# EAGLE design Squama_Ethernet (EAGLE 6.4)

## Sheet 1 of 3
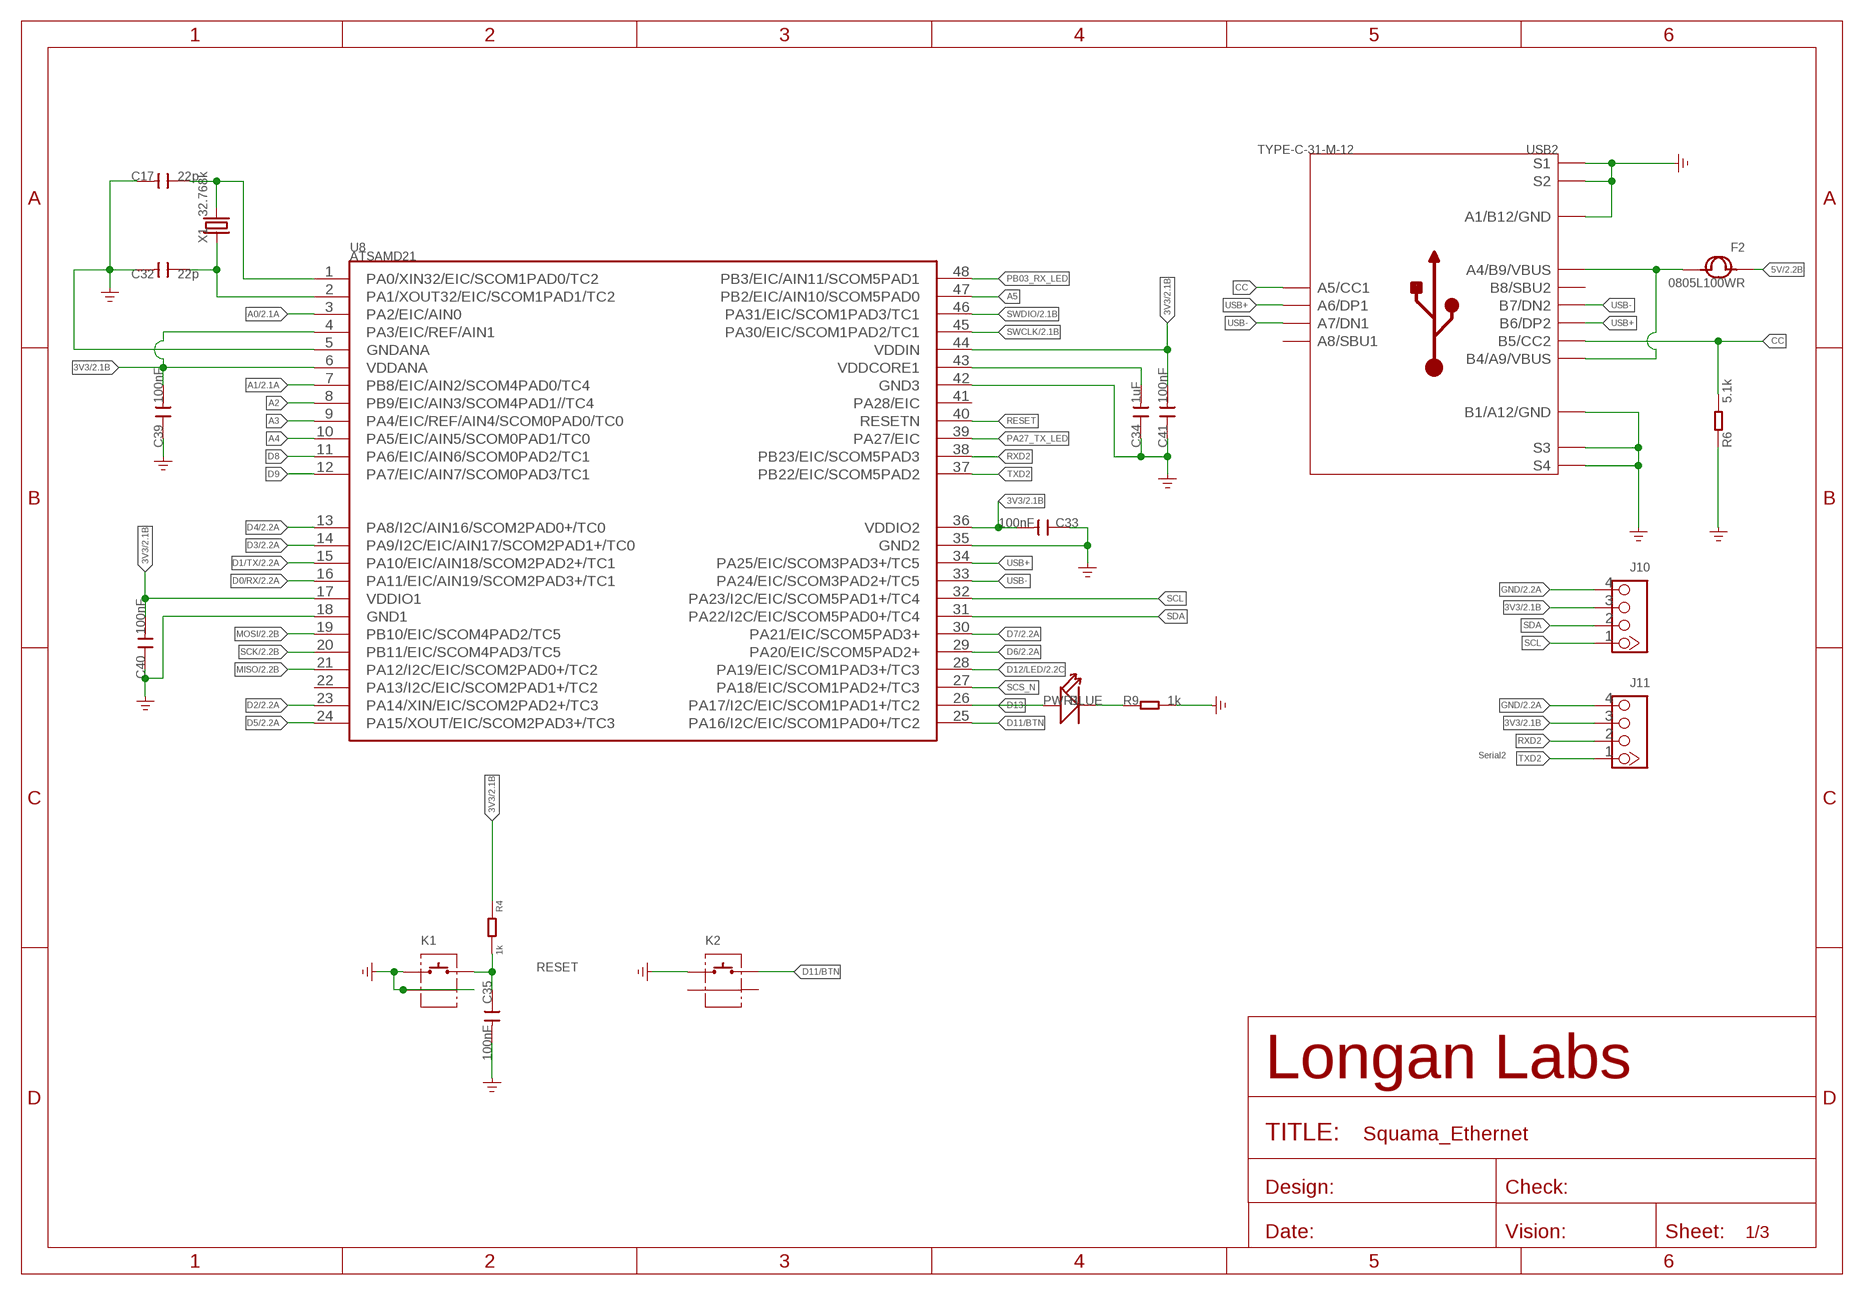
[diagram p0: schematic, sheet 1]

### Parts
C17  22p  CAP-0603  [C0603]
C32  22p  CAP-0603  [C0603]
C33  100nF  CAP-0603  [C0603]
C34  1uF  CAP-0603  [C0603]
C35  100nF  CAP-0603  [C0603]
C39  100nF  CAP-0603  [C0603]
C40  100nF  CAP-0603  [C0603]
C41  100nF  CAP-0603  [C0603]
F2  0805L100WR  FUSE0805  [F0805]
J10  320110033  GROVE-CONNECTOR-DIP-2.0  [HW4-2.0]
J11  320110033  GROVE-CONNECTOR-DIP-2.0  [HW4-2.0]
K1  BUTTON-2+2P  [SW2+2P-7.7X2.75X3.95MM]
K2  BUTTON-2+2P  [SW2+2P-7.7X2.75X3.95MM]
PWR1  BLUE  LED'0603'  [LED-0603]
R4  1k  RES-0603  [R0603]
R6  5.1k  RES-0603  [R0603]
R9  1k  R-0603  [R0603]
U8  ATSAMD21  MCU-ATSAMD21-TQFP48  [TQFP48-0.5-7X7MM]
USB2  TYPE-C-31-M-12  USB2.0-TYPE-C  [USB2.0-TYPE-C]
X1  32.768k  CRYSTAL-2P-3215  [X2-SMD-3.2X1.5X0.55MM]

### Nets
3V3: C33.2 C39.2 C40.2 C41.2 J10.3 J11.3 R4.1 U8.4(PA3/EIC/REF/AIN1) U8.6(VDDANA) U8.17(VDDIO1) U8.36(VDDIO2) U8.44(VDDIN) ; also sheet 2,3
5V [usbvcc]: F2.1 ; also sheet 2
A0: U8.3(PA2/EIC/AIN0) ; also sheet 2
A1: U8.7(PB8/EIC/AIN2/SCOM4PAD0/TC4) ; also sheet 2
A2: U8.8(PB9/EIC/AIN3/SCOM4PAD1//TC4)
A3: U8.9(PA4/EIC/REF/AIN4/SCOM0PAD0/TC0)
A4: U8.10(PA5/EIC/AIN5/SCOM0PAD1/TC0)
A5: U8.47(PB2/EIC/AIN10/SCOM5PAD0)
CC: R6.2 USB2.A5(A5/CC1) USB2.B5(B5/CC2)
D0/RX: U8.16(PA11/EIC/AIN19/SCOM2PAD3+/TC1) ; also sheet 2
D1/TX: U8.15(PA10/EIC/AIN18/SCOM2PAD2+/TC1) ; also sheet 2
D2: U8.23(PA14/XIN/EIC/SCOM2PAD2+/TC3) ; also sheet 2
D3: U8.14(PA9/I2C/EIC/AIN17/SCOM2PAD1+/TC0) ; also sheet 2
D4: U8.13(PA8/I2C/AIN16/SCOM2PAD0+/TC0) ; also sheet 2
D5: U8.24(PA15/XOUT/EIC/SCOM2PAD3+/TC3) ; also sheet 2
D6: U8.29(PA20/EIC/SCOM5PAD2+) ; also sheet 2
D7: U8.30(PA21/EIC/SCOM5PAD3+) ; also sheet 2
D8: U8.11(PA6/EIC/AIN6/SCOM0PAD2/TC1)
D9: U8.12(PA7/EIC/AIN7/SCOM0PAD3/TC1)
D11/BTN: K2.2 U8.25(PA16/I2C/EIC/SCOM1PAD0+/TC2)
D12/LED: U8.28(PA19/EIC/SCOM1PAD3+/TC3) ; also sheet 2
D13: PWR1.+ U8.26(PA17/I2C/EIC/SCOM1PAD1+/TC2)
GND: C17.2 C32.2 C33.1 C34.1 C35.2 C39.1 C40.1 C41.1 J10.4 J11.4 K1.1 K1.S1 K1.S2 K2.1 R6.1 R9.2 U8.5(GNDANA) U8.18(GND1) U8.35(GND2) U8.42(GND3) USB2.A1_B12(A1/B12/GND) USB2.B1_A12(B1/A12/GND) USB2.S1 USB2.S2 USB2.S3 USB2.S4 USB2.S5(S1) USB2.S6(S2) ; supply symbol labelled GND_POWER ; also sheet 2,3
MISO: U8.21(PA12/I2C/EIC/SCOM2PAD0+/TC2) ; also sheet 2,3
MOSI: U8.19(PB10/EIC/SCOM4PAD2/TC5) ; also sheet 2,3
N$2: PWR1.- R9.1
N$3: F2.2 USB2.A4_B9(A4/B9/VBUS) USB2.B4_A9(B4/A9/VBUS)
N$11: C17.1 U8.1(PA0/XIN32/EIC/SCOM1PAD0/TC2) X1.2
N$12: C32.1 U8.2(PA1/XOUT32/EIC/SCOM1PAD1/TC2) X1.1
N$13: C34.2 U8.43(VDDCORE1)
PA27_TX_LED: U8.39(PA27/EIC)
PB03_RX_LED: U8.48(PB3/EIC/AIN11/SCOM5PAD1)
RESET: C35.1 K1.2 R4.2 U8.40(RESETN)
RXD2: J11.2 U8.38(PB23/EIC/SCOM5PAD3)
SCK: U8.20(PB11/EIC/SCOM4PAD3/TC5) ; also sheet 2,3
SCL: J10.1 U8.32(PA23/I2C/EIC/SCOM5PAD1+/TC4)
SCS_N: U8.27(PA18/EIC/SCOM1PAD2+/TC3) ; also sheet 3
SDA: J10.2 U8.31(PA22/I2C/EIC/SCOM5PAD0+/TC4)
SWCLK: U8.45(PA30/EIC/SCOM1PAD2/TC1) ; also sheet 2
SWDIO: U8.46(PA31/EIC/SCOM1PAD3/TC1) ; also sheet 2
TXD2: J11.1 U8.37(PB22/EIC/SCOM5PAD2)
USB+: U8.34(PA25/EIC/SCOM3PAD3+/TC5) USB2.A6(A6/DP1) USB2.B6(B6/DP2)
USB-: U8.33(PA24/EIC/SCOM3PAD2+/TC5) USB2.A7(A7/DN1) USB2.B7(B7/DN2)
Unconnected: K2.S1 K2.S2 U8.22(PA13/I2C/EIC/SCOM2PAD1+/TC2) U8.41(PA28/EIC) USB2.A8(A8/SBU1) USB2.B8(B8/SBU2)

### Notes on the sheet
- Serial2

## Sheet 2 of 3
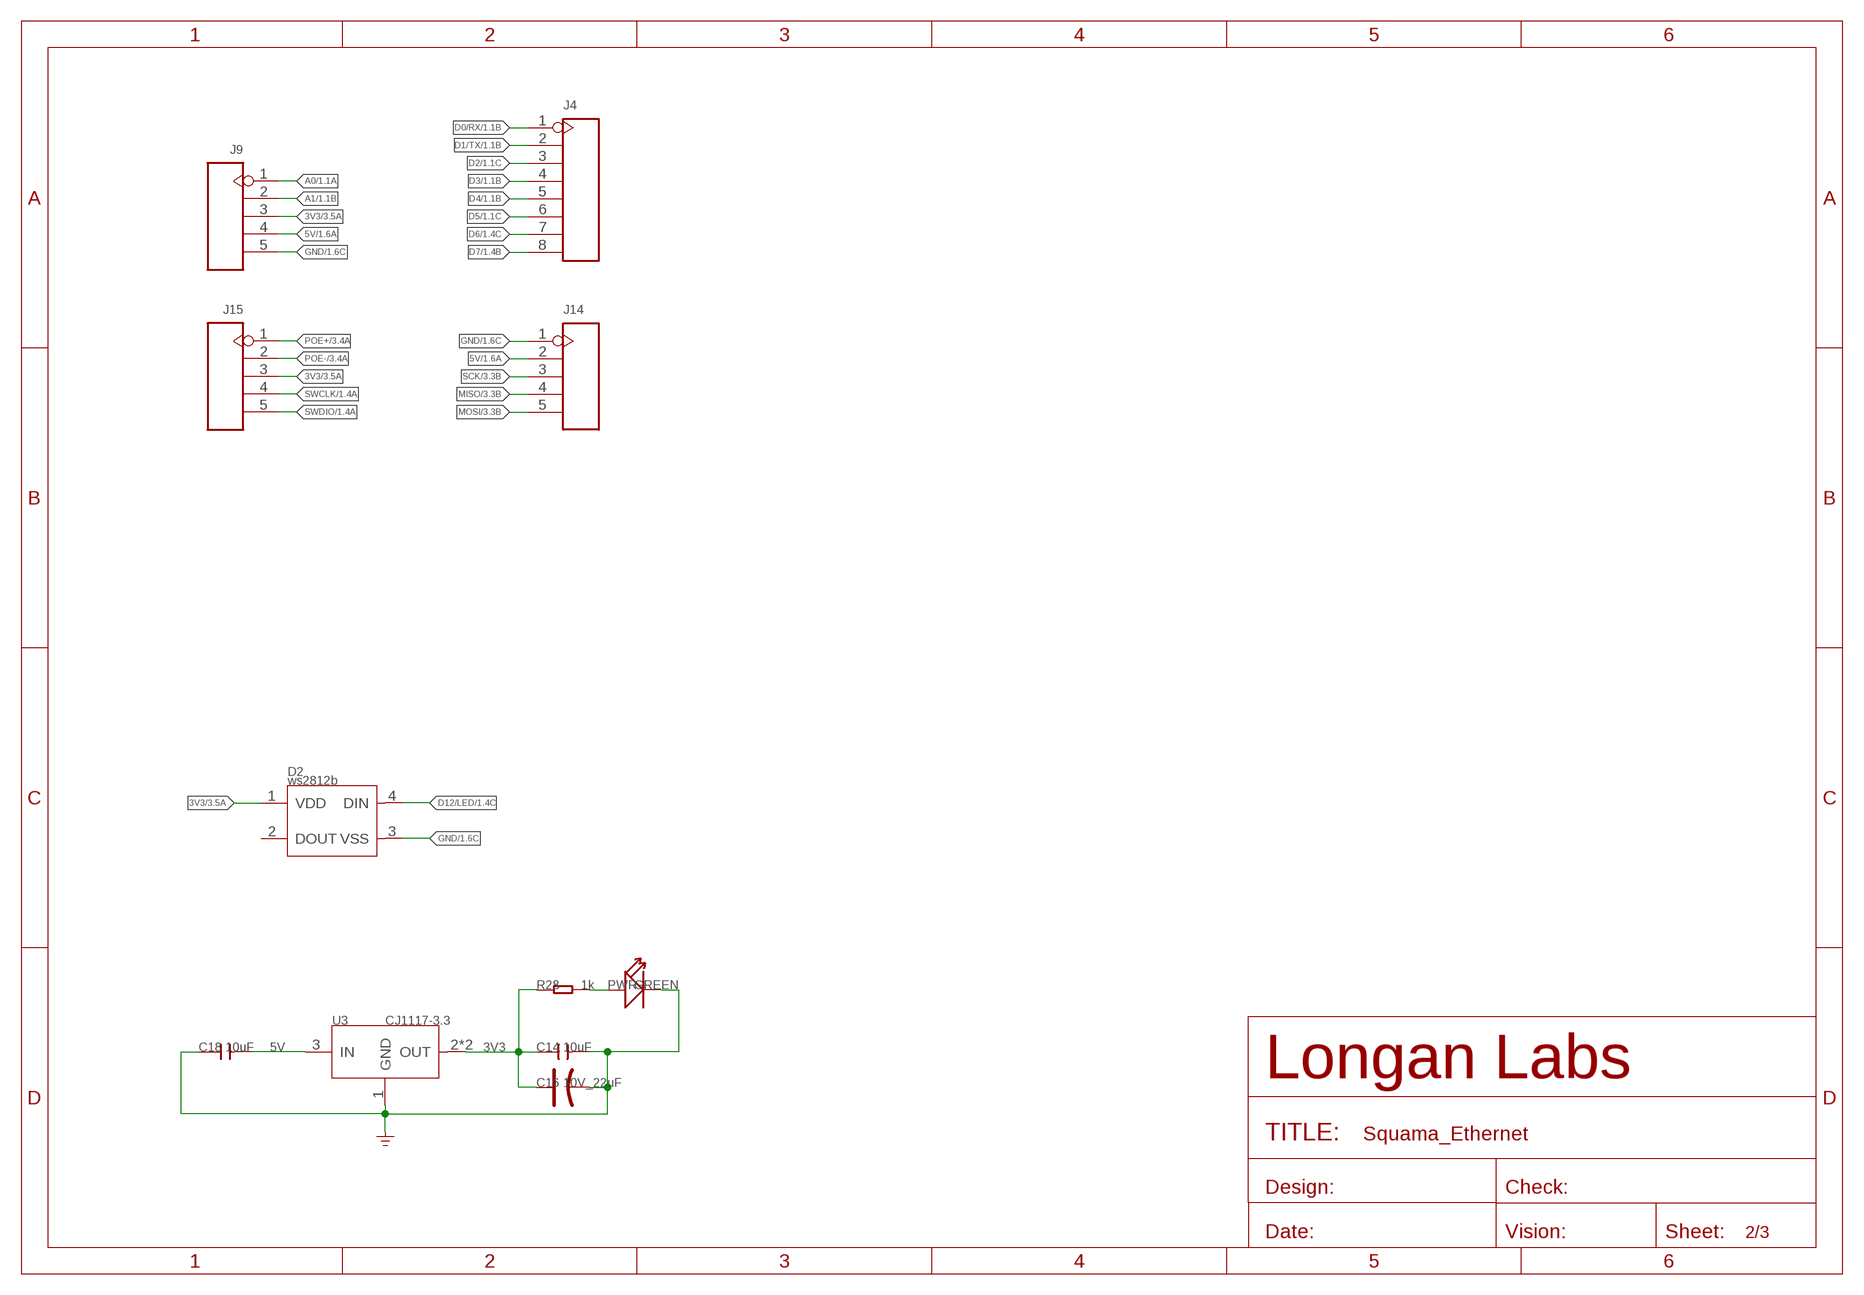
[diagram p1: schematic, sheet 2]

### Parts
C14  10uF  C-0805  [C0805]
C16  10V_22uF  CAP-AVX-B  [AVX-B]
C18  10uF  C-0805  [C0805]
D2  ws2812b  LED-RGB-4P-WS2812B-304990003  [LED4-SMD-5050]
J4  HEADER-8P-80/40MIL  [H8-2.54-C80D40MIL]
J9  HEADER-5P-2.54  [H5-2.54]
J14  HEADER-5P-2.0  [H5-2.0]
J15  HEADER-5P-2.0  [H5-2.0]
PWR  GREEN  LED'0603'  [LED-0603]
R28  1k  R-0603  [R0603]
U3  CJ1117-3.3  PMIC-CJ1117'SOT89'  [SOT-89]

### Nets
3V3: C14.1 C16.+ D2.1(VDD) J9.3 J15.3 R28.1 U3.2(OUT) U3.4(OUT) ; also sheet 1,3
5V [usbvcc]: C18.2 J9.4 J14.2 U3.3(IN) ; also sheet 1
A0: J9.1 ; also sheet 1
A1: J9.2 ; also sheet 1
D0/RX: J4.1 ; also sheet 1
D1/TX: J4.2 ; also sheet 1
D2: J4.3 ; also sheet 1
D3: J4.4 ; also sheet 1
D4: J4.5 ; also sheet 1
D5: J4.6 ; also sheet 1
D6: J4.7 ; also sheet 1
D7: J4.8 ; also sheet 1
D12/LED: D2.4(DIN) ; also sheet 1
GND: C14.2 C16.- C18.1 D2.3(VSS) J9.5 J14.1 PWR.- U3.1(GND) ; supply symbol labelled GND_POWER ; also sheet 1,3
MISO: J14.4 ; also sheet 1,3
MOSI: J14.5 ; also sheet 1,3
N$26: PWR.+ R28.2
POE+: J15.1 ; also sheet 3
POE-: J15.2 ; also sheet 3
SCK: J14.3 ; also sheet 1,3
SWCLK: J15.4 ; also sheet 1
SWDIO: J15.5 ; also sheet 1
Unconnected: D2.2(DOUT)

## Sheet 3 of 3
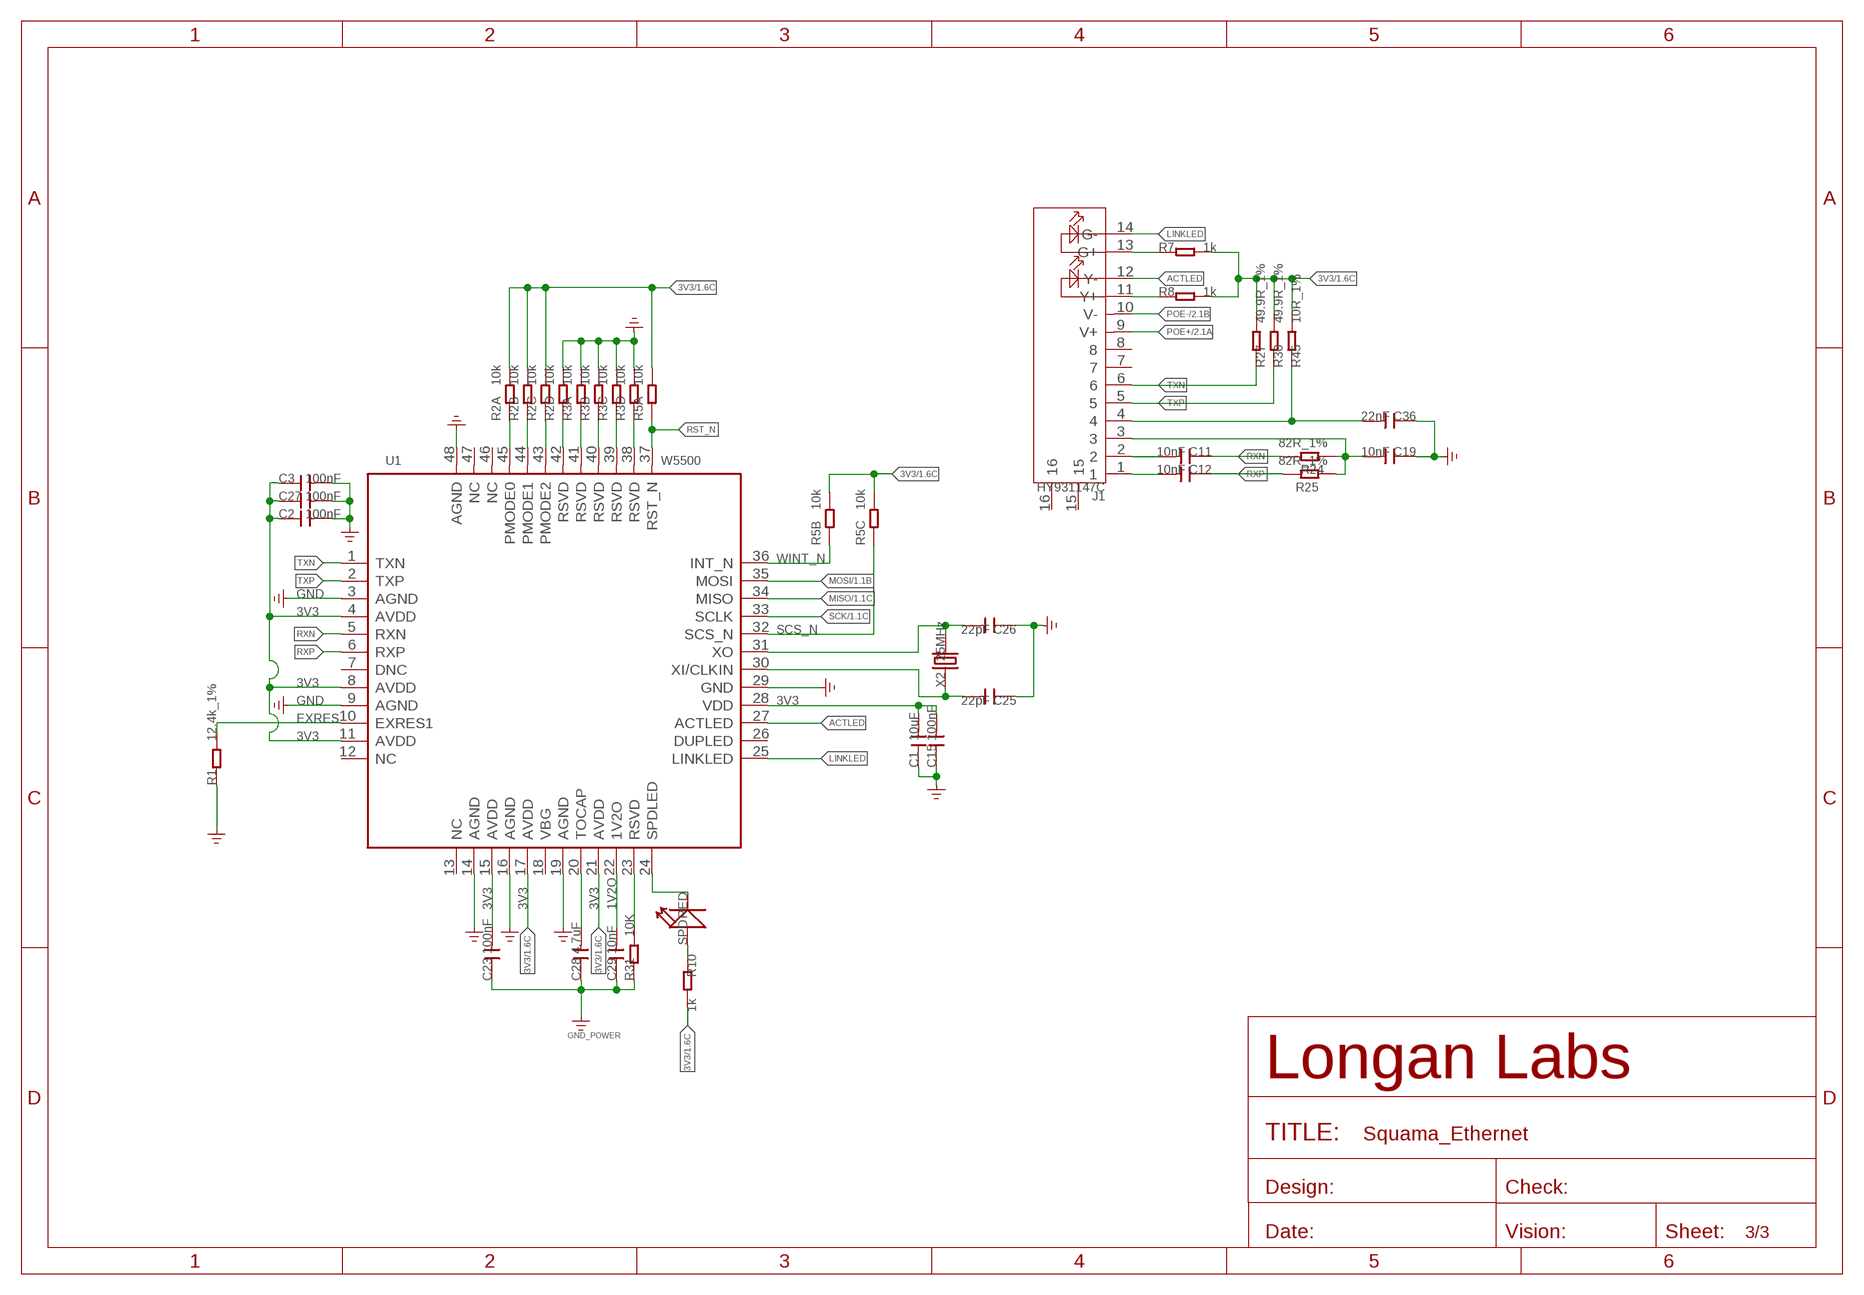
[diagram p2: schematic, sheet 3]

### Parts
C1  10uF  C-0603  [C0603]
C2  100nF  C-0603  [C0603]
C3  100nF  C-0603  [C0603]
C11  10nF  C-0603  [C0603]
C12  10nF  C-0603  [C0603]
C15  100nF  C-0603  [C0603]
C19  10nF  C-0603  [C0603]
C23  100nF  C-0603  [C0603]
C25  22pF  C-0603  [C0603]
C26  22pF  C-0603  [C0603]
C27  100nF  C-0603  [C0603]
C28  4.7uF  C-0805  [C0805]
C29  10nF  C-0603  [C0603]
C36  22nF  C-0603  [C0603]
J1  HY931147C  RJ45-HY931147C  [RJ45-14+2P-16.1X21.6X13.95MM]
R1  12.4k_1%  R-0603  [R0603]
R2  10k  RES-ARRAY-0804  [R0804-8]
R3  10k  RES-ARRAY-0804  [R0804-8]
R5  10k  RES-ARRAY-0804  [R0804-8]
R7  1k  R-0603  [R0603]
R8  1k  R-0603  [R0603]
R10  1k  R-0603  [R0603]
R24  82R_1%  R-0603  [R0603]
R25  82R_1%  R-0603  [R0603]
R27  49.9R_1%  R-0603  [R0603]
R30  49.9R_1%  R-0603  [R0603]
R31  10K  R-0603  [R0603]
R45  10R_1%  R-0603  [R0603]
SPD  RED  LED'0603'  [LED-0603]
U1  W5500  DRIVER-W5500  [LQFP-48]
X2  25MHz  CRYSTAL'5032'  [2P-SMD-5X3.2]

### Nets
1V2O: C29.2 U1.22(1V2O)
3V3: C1.2 C2.1 C3.1 C15.2 C23.2 C27.1 R2.6 R2.7 R2.8 R5.6 R5.7 R5.8 R7.2 R8.2 R10.2 R27.2 R30.2 R45.2 U1.4(AVDD) U1.8(AVDD) U1.11(AVDD) U1.15(AVDD) U1.17(AVDD) U1.21(AVDD) U1.28(VDD) ; also sheet 1,2
ACTLED: J1.12(Y-) U1.27(ACTLED)
EXRES: R1.2 U1.10(EXRES1)
GND: C1.1 C2.2 C3.2 C15.1 C19.1 C23.1 C25.1 C26.1 C27.2 C28.1 C29.1 C36.1 R1.1 R2.5 R3.5 R3.6 R3.7 R3.8 R31.1 U1.3(AGND) U1.9(AGND) U1.14(AGND) U1.16(AGND) U1.19(AGND) U1.29(GND) U1.48(AGND) ; supply symbol labelled GND_POWER ; also sheet 1,2
LINKLED: J1.14(G-) U1.25(LINKLED)
MISO: U1.34(MISO) ; also sheet 1,2
MOSI: U1.35(MOSI) ; also sheet 1,2
N$1: C25.2 U1.30(XI/CLKIN) X2.1
N$4: J1.13(G+) R7.1
N$5: J1.11(Y+) R8.1
N$6: R10.1 SPD.+
N$7: SPD.- U1.24(SPDLED)
N$16: C36.2 J1.4 R45.1
N$23: C11.2 J1.2
N$24: C12.2 J1.1
N$27: R3.4 U1.38(RSVD)
N$30: R3.3 U1.39(RSVD)
N$31: R3.2 U1.40(RSVD)
N$32: R3.1 U1.41(RSVD)
N$33: R2.4 U1.42(RSVD)
N$34: C19.2 J1.3 R24.2 R25.1
N$35: R2.3 U1.43(PMODE2)
N$36: R2.2 U1.44(PMODE1)
N$37: R2.1 U1.45(PMODE0)
N$50: R31.2 U1.23(RSVD)
POE+: J1.9(V+) ; also sheet 2
POE-: J1.10(V-) ; also sheet 2
RST_N: R5.1 U1.37(RST_N)
RXN: C11.1 R24.1 U1.5(RXN)
RXP: C12.1 R25.2 U1.6(RXP)
SCK: U1.33(SCLK) ; also sheet 1,2
SCS_N: R5.3 U1.32(SCS_N) ; also sheet 1
TOCAP: C28.2 U1.20(TOCAP)
TXN: J1.6 R27.1 U1.1(TXN)
TXP: J1.5 R30.1 U1.2(TXP)
WINT_N: R5.2 U1.36(INT_N)
XO: C26.2 U1.31(XO) X2.2
Unconnected: J1.7 J1.8 J1.15 J1.16 R5.4 R5.5 U1.7(DNC) U1.12(NC) U1.13(NC) U1.18(VBG) U1.26(DUPLED) U1.46(NC) U1.47(NC)

## Library data of the parts
C1-C3 C11 C12 C14 C15 C18 C19 C23 C25-C29 C36 = Discrete:C*: Ceramic Capacitors
C16 = Discrete:CAP*: Electrolytic Capacitors,Tantalum Capacitors and Super Capacitors
C17 C32-C35 C39-C41 = Discrete-new:CAP: Ceramic Capacitors
D2 = Discrete-new:LED-RGB-4P
F2 = Discrete-small:FUSE
J1 = Connector-new:RJ45-HY931147C
J4 = Connector-new:HEADER-8P
J9 J14 J15 = Connector-new:HEADER-5P
J10 J11 = Connector-new:GROVE-CONNECTOR-DIP: 4P-2.0:320110033;4P-2.0-90D:320110034
K1 K2 = Connector-new:BUTTON-2+2P
PWR PWR1 SPD = Discrete:LED*
R1 R7-R10 R24 R25 R27 R28 R30 R31 R45 = Discrete:R*
R2 R3 R5 = Discrete-new:RES-ARRAY: Resistor Array
R4 R6 = Discrete-new:RES
U1 = template:DRIVER-W5500
U3 = IC-new:PMIC-CJ*1117: Low Drop Fixed And Adjustable Positive Voltage Regulators http://www.datasheetcatalog.org/datasheet/SGSThomsonMicroelectronics/mXuqtqv.pdf
U8 = IC-new:MCU-ATSAMD21: Atmel D21 32bit ARM Cortex-M0 microcontroller - 48 PIN TQFP 256KB flash memory + 32KB SRAM
USB2 = Connector-new:USB2.0-TYPE-C
X1 = Discrete-new:CRYSTAL-2P
X2 = Discrete:CRYSTAL*: CRYSTAL

## Net classes
0 default: width 0 mm, drill 0 mm

## Board
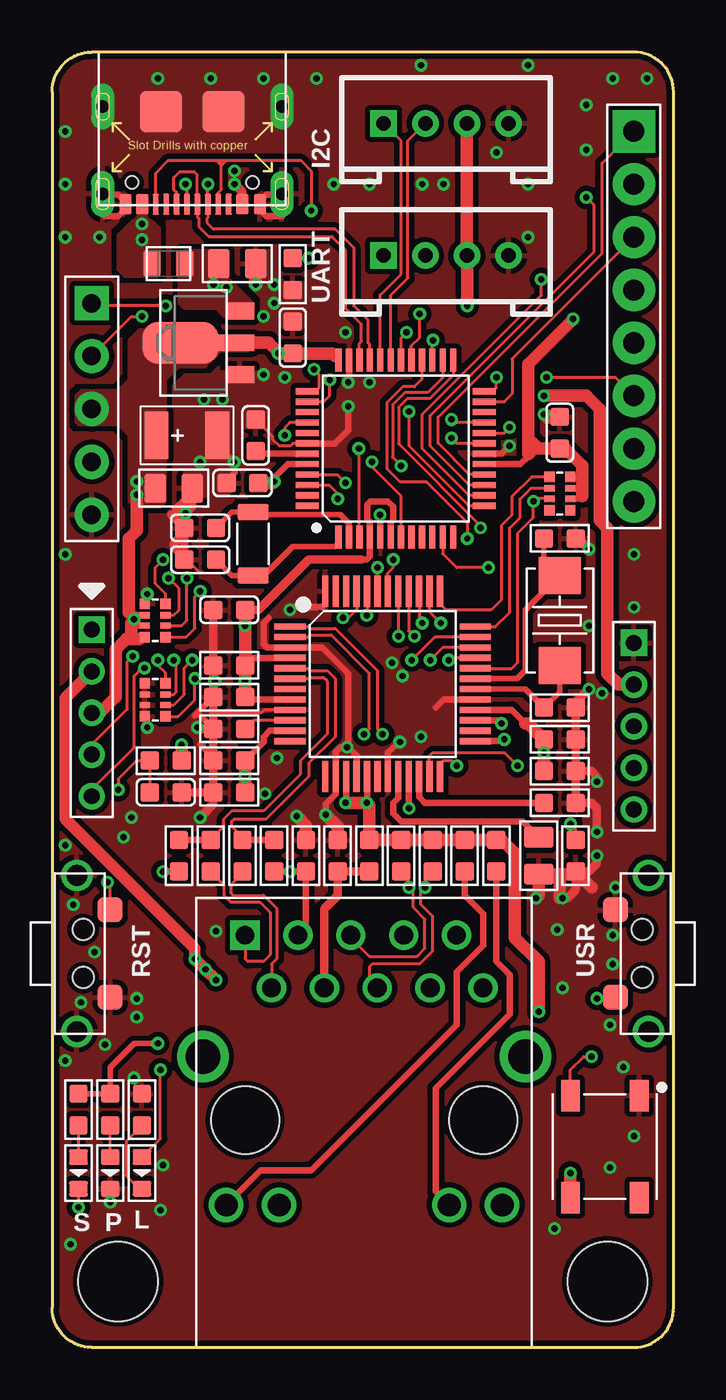
[diagram p3: board, top side]
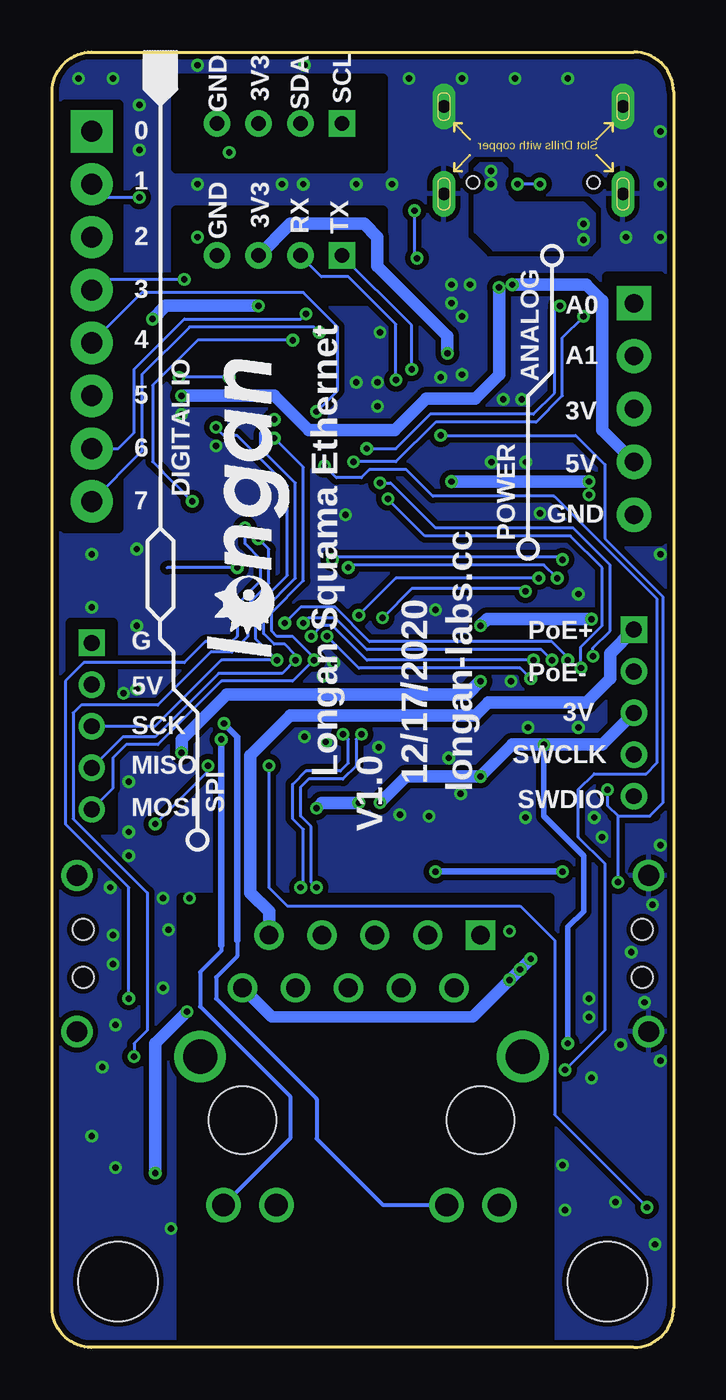
[diagram p4: board, bottom side, seen from below]

Size 29.84 x 62.23 mm. Coordinates in mm from the lower left corner, seen from the top.
Outline: 1.91,0 27.94,0 arc90 29.84,1.91 29.84,60.33 arc90 27.94,62.23 1.91,62.23 arc90 0,60.33 0,1.91 arc90 1.91,0
Copper layers (1*16): Top 0.035mm / dielectric 1.5mm / Bottom 0.035mm
Design rules "default *": minimum track width 5mil, minimum drill 12mil, track to track 5mil, track to pad 5mil, pad to pad 5mil, via to via 5mil, smd to smd 0mil, copper to edge 10mil, drill to drill 10mil, minimum pad ring 10mil, minimum via ring 6mil, stop-mask expansion 2mil, vias tented up to drill 25mil, thermal gap 10mil
Holes 3.81 mm at 26.67,3.17 3.17,3.17
bRestrict: area 0.6,38.7 to 3.2,51.4; area 0.9,25.5 to 2.9,35.4; area 14,56.6 to 23.9,61; area 14,50.3 to 23.9,54.6; area 26.7,39.4 to 29.2,59.7; area 26.9,24.9 to 29,34.8; area 6,0 to 23.6,21.6; area 0.6,38.7 to 3.2,51.4

### Footprints (pad centres in the part's own frame; a part is rotated, then mirrored left to right if it is on the bottom)
C0603 = smd 0.889 x 0.889: 1 -0.762,0; 2 0.762,0
C0805 = smd 1.016 x 1.397: 1 -0.889,0; 2 0.889,0
AVX-B = smd 1.143 x 2.286: + -1.46,0; - 1.46,0
LED4-SMD-5050 = smd 0.9 x 1.5: 1 -1.65,-2.45; 2 1.65,-2.45; 3 1.65,2.45; 4 -1.65,2.45
F0805 = smd 0.819 x 1.27: 1 -0.79,0; 2 0.79,0
RJ45-14+2P-16.1X21.6X13.95MM = drill 0.9 pad 1.4 square: 1 5.72,-8.89 | drill 0.9 pad 1.4: 2 4.45,-6.35; 3 3.18,-8.89; 4 1.91,-6.35; 5 0.64,-8.89; 6 -0.63,-6.35; 7 -1.9,-8.89; 8 -3.17,-6.35; 9 -4.44,-8.89; 10 -5.71,-6.35 | drill 1.1 pad 1.6: 11 6.625,4.08; 12 4.085,4.08; 13 -4.085,4.08; 14 -6.625,4.08 | drill 1.65 pad 2.3: 15 7.745,-3.05; 16 -7.745,-3.05 | hole 3.25: -5.715,0; 5.715,0
H8-2.54-C80D40MIL = drill 1.016 pad 2.032 square: 1 0,8.89 | drill 1.016 pad 2.032: 2 0,6.35; 3 0,3.81; 4 0,1.27; 5 0,-1.27; 6 0,-3.81; 7 0,-6.35; 8 0,-8.89
H5-2.54 = drill 0.889 pad 1.651 square: 1 0,5.08 | drill 0.889 pad 1.651: 2 0,2.54; 3 0,0; 4 0,-2.54; 5 0,-5.08
HW4-2.0 = drill 0.7 pad 1.27 square: 1 -3,0 | drill 0.7 pad 1.27: 2 -1,0; 3 1,0; 4 3,0
H5-2.0 = drill 0.762 pad 1.27 square: 1 0,4 | drill 0.762 pad 1.27: 2 0,2; 3 0,0; 4 0,-2; 5 0,-4
SW2+2P-7.7X2.75X3.95MM = smd 1.2 x 1.2: 1 -2.1,0; 2 2.1,0 | drill 1 pad 1.5: S1 -3.75,1.6; S2 3.75,1.6 | hole 1: -1.15,1.3; 1.15,1.3
LED-0603 = smd 0.762 x 0.889: + -0.762,0; - 0.762,0
R0603 = smd 0.889 x 0.889: 1 -0.762,0; 2 0.762,0
R0804-8 = smd 0.498 x 0.5: 1 -0.801,-0.5; 4 0.801,-0.5; 5 0.801,0.5; 8 -0.801,0.5 | smd 0.3 x 0.5: 2 -0.25,-0.5; 3 0.25,-0.5; 6 0.25,0.5; 7 -0.25,0.5
LQFP-48 = smd 1.5 x 0.3: 1 -4.45,2.75; 2 -4.45,2.25; 3 -4.45,1.75; 4 -4.45,1.25; 5 -4.45,0.75; 6 -4.45,0.25; 7 -4.45,-0.25; 8 -4.45,-0.75; 9 -4.45,-1.25; 10 -4.45,-1.75; 11 -4.45,-2.25; 12 -4.45,-2.75; 25 4.45,-2.75; 26 4.45,-2.25; 27 4.45,-1.75; 28 4.45,-1.25; 29 4.45,-0.75; 30 4.45,-0.25; 31 4.45,0.25; 32 4.45,0.75; 33 4.45,1.25; 34 4.45,1.75; 35 4.45,2.25; 36 4.45,2.75 | smd 0.3 x 1.5: 13 -2.75,-4.45; 14 -2.25,-4.45; 15 -1.75,-4.45; 16 -1.25,-4.45; 17 -0.75,-4.45; 18 -0.25,-4.45; 19 0.25,-4.45; 20 0.75,-4.45; 21 1.25,-4.45; 22 1.75,-4.45; 23 2.25,-4.45; 24 2.75,-4.45; 37 2.75,4.45; 38 2.25,4.45; 39 1.75,4.45; 40 1.25,4.45; 41 0.75,4.45; 42 0.25,4.45; 43 -0.25,4.45; 44 -0.75,4.45; 45 -1.25,4.45; 46 -1.75,4.45; 47 -2.25,4.45; 48 -2.75,4.45
SOT-89 = smd 0.8 x 1.4: 1 -1.524,-1.905; 3 1.524,-1.905 | smd 0.8 x 1.9: 2 0,-1.651 | smd 2.032 x 3.65: 4 0,0.94
TQFP48-0.5-7X7MM = smd 0.3 x 1.1: 1 -2.75,-4.25; 2 -2.25,-4.25; 3 -1.75,-4.25; 4 -1.25,-4.25; 5 -0.75,-4.25; 6 -0.25,-4.25; 7 0.25,-4.25; 8 0.75,-4.25; 9 1.25,-4.25; 10 1.75,-4.25; 11 2.25,-4.25; 12 2.75,-4.25; 25 2.75,4.25; 26 2.25,4.25; 27 1.75,4.25; 28 1.25,4.25; 29 0.75,4.25; 30 0.25,4.25; 31 -0.25,4.25; 32 -0.75,4.25; 33 -1.25,4.25; 34 -1.75,4.25; 35 -2.25,4.25; 36 -2.75,4.25 | smd 1.1 x 0.3: 13 4.25,-2.75; 14 4.25,-2.25; 15 4.25,-1.75; 16 4.25,-1.25; 17 4.25,-0.75; 18 4.25,-0.25; 19 4.25,0.25; 20 4.25,0.75; 21 4.25,1.25; 22 4.25,1.75; 23 4.25,2.25; 24 4.25,2.75; 37 -4.25,2.75; 38 -4.25,2.25; 39 -4.25,1.75; 40 -4.25,1.25; 41 -4.25,0.75; 42 -4.25,0.25; 43 -4.25,-0.25; 44 -4.25,-0.75; 45 -4.25,-1.25; 46 -4.25,-1.75; 47 -4.25,-2.25; 48 -4.25,-2.75
USB2.0-TYPE-C = smd 1 x 0.6: A1_B12 -0.05,3.25; A4_B9 -0.05,2.4; B1_A12 -0.05,-3.2; B4_A9 -0.05,-2.4 | smd 1 x 0.3: A5 -0.05,1.25; A6 -0.05,0.25; A7 -0.05,-0.25; A8 -0.05,-1.25; B5 -0.05,-1.75; B6 -0.05,-0.75; B7 -0.05,0.75; B8 -0.05,1.75 | drill 0.6 pad 1 long: S1 -4.75,4.3; S2 -4.75,-4.3 | drill 0.6 pad 1.1 long: S3 -0.55,4.3; S4 -0.55,-4.3 | smd 2 x 2: S5 -4.5,1.5; S6 -4.5,-1.5 | hole 0.6: -1.1,-2.89; -1.1,2.89
X2-SMD-3.2X1.5X0.55MM = smd 0.762 x 1.524: 1 -1.524,0; 2 1.524,0
2P-SMD-5X3.2 = smd 1.778 x 2.032: 1 -2.159,0; 2 2.159,0

### Placement (x,y rotation side)
C1  24.38,27.69 180 top
C2  8.51,28.19 180 top
C3  8.51,32.77 180 top
C11  9.14,23.62 270 top
C12  7.62,23.62 270 top
C14  5.84,41.27 0 top
C15  24.38,29.21 180 top
C16  6.48,43.81 0 top
C17  7.11,37.85 180 top
C18  8.89,52.07 180 top
C19  12.19,23.62 270 top
C23  8.51,26.67 0 top
C25  24.38,30.73 180 top
C26  24.38,38.86 180 top
C27  8.51,31.24 180 top
C28  23.37,23.62 90 top
C29  24.38,26.16 180 top
C32  7.11,39.37 180 top
C33  11.56,48.51 270 top
C34  9.78,43.81 270 top
C35  5.46,26.67 0 top
C36  13.72,23.62 270 top
C39  8.51,35.43 0 top
C40  24.38,43.94 270 top
C41  9.14,41.53 0 top
D2  26.54,9.65 0 top
F2  5.59,52.07 180 top
J1  14.99,10.92 180 top
J4  27.94,49.53 0 top
J9  1.91,45.09 0 top
J10  18.92,58.8 0 top
J11  18.92,52.45 0 top
J14  27.94,29.84 0 top
J15  1.91,30.48 0 top
K1  2.79,18.92 90 top
K2  27.05,18.92 270 top
PWR  2.79,8.38 270 top
PWR1  4.32,8.38 270 top
R1  8.51,29.72 0 top
R2  4.95,34.92 90 top
R3  4.95,31.11 90 top
R4  5.46,28.19 180 top
R5  24.38,41.02 270 top
R6  11.56,51.56 90 top
R7  21.34,23.62 90 top
R8  19.81,23.62 90 top
R9  4.32,11.43 90 top
R10  1.27,11.43 90 top
R24  10.67,23.62 270 top
R25  6.1,23.62 90 top
R27  18.29,23.62 90 top
R28  2.79,11.43 270 top
R30  16.76,23.62 90 top
R31  25.15,23.62 90 top
R45  15.24,23.62 90 top
SPD  1.27,8.38 270 top
U1  15.88,31.88 0 top
U3  7.11,48.26 90 top
U8  16.51,43.18 0 top
U$7  [LONGAN-SILK-SMALLER]  17.27,31.88 90 bottom
USB2  6.73,54.86 270 top
X1  9.65,38.61 270 top
X2  24.38,34.92 90 top

### Tracks (layer width: path | path; a pad name or v marks a point on that pad's centre or on a via)
1V2O
  Top 0.305: U1.22 17.62,26.44 17.91,26.16 C29.2
3V3  (via drill 0.3 pad 0.61)
  Top 0.254: R10.2 2.67,12.19 2.79,12.06 R28.1 2.79,13.46 3.94,14.61 v5.08,14.61
  Top 0.305: U1.15 14.12,26.19 v14.1,26.16 | U1.17 15.12,26.17 v15.11,26.16 | U1.21 17.12,25.93 v17.14,25.91 | U1.28 22.08,30.63 22.73,29.97 | U1.8 9.39,31.13 C27.1 | U1.11 10.45,29.63 10.16,29.34 10.16,29.08 C2.1 | U1.4 9.63,33.13 C3.1 | 14.86,37.85 15.11,37.85 15.26,37.99 U8.4 15.26,39.67 15.14,39.79 15.14,40.49 15.29,40.64 16.13,40.64 16.38,40.39 16.38,39.75 16.26,39.63 U8.6 | U8.17 22.49,42.43 22.86,42.8 22.86,42.93 | R2.7 4.12,34.67 3.94,34.86 3.94,34.92 v3.94,34.99 4.12,35.17 R2.6 | U8.36 13.76,47.45 13.59,47.62 | U8.44 11.31,42.43 10.67,41.78 v10.67,41.59 | R5.7 25.46,41.27 | R5.6 25.34,40.77 25.46,40.89 | R5.8 25.42,41.82 25.46,41.78
  Top 0.406: C39.2 9.91,35.43 12.32,37.85 14.86,37.85 | R2.8 4.28,34.12 4.19,34.04
  Top 0.61: C23.2 v9.27,27.43 C2.1 | v14.1,26.16 v15.11,26.16 15.24,26.04 R45.2 R30.2 R27.2 R8.2 R7.2 21.59,24.38 22.23,23.75 22.23,19.68 23.37,18.54 v23.37,16.13 | 22.73,29.97 22.86,29.97 C15.2 v23.62,28.57 C1.2 | C27.1 v9.27,32 C3.1 v9.27,34.67 C39.2 | R4.1 v6.22,28.96 | J15.3 2.29,30.48 3.05,31.24 3.05,33.53 3.56,34.04 3.81,34.04 | 3.81,34.04 4.19,34.04 | 3.81,34.04 3.81,34.8 3.94,34.92 | 13.59,47.62 13.46,47.75 C33.2 10.92,47.75 | C41.2 10.6,41.53 v10.67,41.59 | v3.94,34.99 3.94,35.05 3.68,35.31 3.68,38.86 4.06,39.24 v4.06,40.96 | 25.46,40.89 25.46,41.27 25.46,41.78 25.46,42.35 24.64,43.18 C40.2 23.37,43.18 | J10.3 J11.3 19.94,52.44 v19.94,50.04 | 22.86,43.18 22.86,42.93 23.11,43.18 | 22.86,43.18 22.86,43.69 | 22.86,43.69 22.86,47.24 v25.02,49.4 | 23.11,43.18 22.86,43.18 | 23.37,43.18 23.11,43.18 | 23.37,43.18 22.86,43.69 | D2.1 v24.89,8.38 | 10.92,47.75 v10.86,47.75 | U3.2 10.41,48.26 10.92,47.75
  Bottom 0.254: v5.08,14.61 5.08,20.19 4.32,20.95 4.32,23.62 6.22,25.53 v6.22,28.96
  Bottom 0.61: v14.1,26.16 12.83,27.43 v9.27,27.43 7.75,28.96 v6.22,28.96 3.43,28.96 J15.3 | v15.11,26.16 16.89,26.16 v17.14,25.91 | v23.62,28.57 C15.2 21.46,31.37 9.91,31.37 v9.27,32 | v3.94,34.99 8.95,34.99 v9.27,34.67 | v10.86,47.75 10.86,48.58 14.22,51.94 14.22,53.34 14.86,53.98 18.4,53.98 J11.3 | v25.02,49.4 24.38,50.04 v19.94,50.04 | v10.67,41.59 v4.06,41.59 | v24.89,8.38 24.89,14.61 v23.37,16.13
  pour Top (isolate 0.254, no thermals): 7.62,48.9 4.19,48.9 3.68,48.39 3.68,46.48 3.17,45.97 1.4,45.97 1.14,45.72 1.14,44.45 1.27,44.32 3.17,44.32 3.68,43.81 3.68,40.64 3.94,40.39 5.21,40.39 5.46,40.64 5.46,46.48 6.1,47.12 7.37,47.12 8.13,47.88 9.4,47.88 9.53,48.01 9.53,48.39 9.4,48.51 8,48.51
5V  (via drill 0.3 pad 0.61)
  Top 0.61: J14.2 27.21,31.84 26.67,32.38 26.67,39.37 26.29,39.75 26.29,45.09 25.65,45.72 v23.62,45.72
  Bottom 0.61: J9.4 3.43,44.07 3.43,50.29 4.19,51.05 v7.75,51.05 | v8.38,50.93 8.38,46.74 9.53,45.59 11.87,45.59 13.4,44.07 17.53,44.07 19.18,45.72 v23.62,45.72
  pour Top (isolate 0.254, no thermals): 6.73,52.7 8,52.7 8.38,52.32 8.38,51.44 9.65,50.16 9.65,49.78 9.4,49.53 8.26,49.53 7.87,49.91 6.35,49.91 6.1,50.16 6.1,52.45 6.35,52.7
A0  (via drill 0.3 pad 0.61)
  Top 0.152: U8.3 14.76,43.15 v14.73,43.18 | v5.46,50.04 2.03,50.04 J9.1
  Bottom 0.152: v5.46,50.04 5.71,49.78 5.71,45.85 6.73,44.83 11.68,44.83 13.34,43.18 v14.73,43.18
A1  (via drill 0.3 pad 0.61)
  Top 0.152: J9.2 3.81,49.53 v4.32,49.53 | v15.37,42.55 15.37,42.29 16.76,40.9 U8.7
  Bottom 0.152: v4.32,49.53 5.33,48.51 5.33,45.72 6.6,44.45 11.43,44.45 13.34,42.55 v15.37,42.55
ACTLED  (via drill 0.3 pad 0.61)
  Top 0.305: U1.27 21.43,30.13 v21.59,29.97
  Bottom 0.203: 20.95,19.56 20.95,18.8 21.97,17.78 21.97,16.76 17.14,11.94 17.14,10.03 13.97,6.86 10.92,6.86 J1.12
  Bottom 0.305: 20.95,19.56 20.95,29.34 v21.59,29.97
CC  (via drill 0.3 pad 0.61)
  Top 0.152: USB2.A5 7.98,55.48 8.13,55.63 8.13,56.77 | USB2.B5 4.98,56.42 5.59,57.02 7.87,57.02 | 8.13,56.77 8.13,57.02 | 7.87,57.02 8.13,57.02 | 8.13,57.02 8.38,57.02 | 8.38,57.02 11.94,57.02 12.45,56.52 v12.45,54.61 | 8.13,56.77 7.87,57.02 | 8.38,57.02 8.13,56.77 | R6.2 v12.32,52.32
  Bottom 0.152: v12.45,54.61 12.45,52.45 v12.32,52.32
D0/RX
  Top 0.152: U8.16 20.05,41.93 18.54,43.43 18.54,44.7 26.42,52.58 26.42,56.9 J4.1
D1/TX  (via drill 0.3 pad 0.61)
  Top 0.152: U8.15 20.04,41.43 18.16,43.31 18.16,44.77 26.04,52.64 26.04,54.86 v25.65,55.24
  Bottom 0.152: v25.65,55.24 27.3,55.24 J4.2
D2
  Top 0.152: U8.23 21.72,45.43 22.1,45.81 22.1,47.5 J4.3
D3  (via drill 0.3 pad 0.61)
  Top 0.152: U8.14 20.03,40.93 17.78,43.18 17.78,44.83 23.5,50.55 v23.5,51.31
  Bottom 0.152: J4.4 27.43,51.31 v23.5,51.31
D4  (via drill 0.3 pad 0.61)
  Top 0.152: v17.14,44.96 17.14,43.31 19.94,40.51 20,40.45 20.02,40.43 U8.13
  Bottom 0.152: J4.5 25.53,50.67 17.78,50.67 16.13,49.02 16.13,45.97 v17.14,44.96
D5  (via drill 0.3 pad 0.61)
  Top 0.152: U8.24 21.16,45.93 21.34,46.1 v21.34,46.61 | v23.75,46.61 27.05,46.61 J4.6
  Bottom 0.152: v21.34,46.61 v23.75,46.61
D6  (via drill 0.3 pad 0.61)
  Top 0.152: U8.29 17.26,48.12 17.65,48.51 v17.65,49.66
  Bottom 0.152: J4.7 26.67,43.18 25.91,43.94 25.91,46.99 23.5,49.4 17.91,49.4 v17.65,49.66
D7  (via drill 0.3 pad 0.61)
  Top 0.152: U8.30 16.76,48.51 v17.02,48.77
  Bottom 0.152: J4.8 25.53,43.05 25.53,46.74 23.24,49.02 17.27,49.02 v17.02,48.77
D8  (via drill 0.3 pad 0.61)
  Top 0.152: U8.11 18.76,38.14 18.86,38.04 18.92,37.97 19.43,37.47 v20.95,37.47
  Bottom 0.152: v20.95,37.47 24.32,37.47
D11/BTN  (via drill 0.3 pad 0.61)
  Top 0.152: U8.25 19.26,46.71 18.15,45.59 17.06,45.59 16.64,45.17 16.64,43.42 20.57,39.48 v20.57,39.37 | K2.2 26.22,16.82 v26.16,16.76
  Bottom 0.152: v20.57,39.37 20.57,38.61 19.81,37.85 19.81,36.83 20.95,35.69 20.95,34.16 21.21,33.91 22.48,33.91 23.5,32.89 28.32,32.89 29.21,32 29.21,25.15 26.16,22.1 v26.16,16.76
D12/LED  (via drill 0.3 pad 0.61)
  Top 0.152: U8.28 17.76,46.51 17.4,46.15 16.83,46.15 16.08,45.4 16.08,42.22 16.7,41.59 17.97,41.59 19.93,39.62 v19.93,38.87 v19.94,38.86 | D2.4 24.89,13.34 25.53,13.97 v25.91,13.97
  Bottom 0.152: v25.91,13.97 25.91,14.61 25.27,15.24 25.27,21.84 28.83,25.4 28.83,30.48 28.45,30.86 24.77,30.86 22.23,33.4 21.21,33.4 20.45,34.16 20.45,35.69 19.43,36.7 19.43,38.35 v19.94,38.86
D13  (via drill 0.3 pad 0.61)
  Top 0.152: U8.26 18.76,46.6 18.03,45.87 16.95,45.87 16.36,45.28 16.36,42.76 v16.76,42.35 | PWR1.+ 5.21,10.03 v5.21,13.34
  Bottom 0.152: v16.76,42.35 16.19,41.78 14.99,41.78 14.61,42.16 12.83,42.16 11.56,40.89 5.73,40.89 0.81,35.98 0.81,28.07 1.32,27.56 3.81,27.56 4.57,26.8 4.57,24.51 3.3,23.24 3.3,15.24 v5.21,13.34
EXRES
  Top 0.152: U1.10 9.68,30.13 R1.2
GND  (via drill 0.3 pad 0.61)
  Top 0.152: U1.9 10.18,30.63 10.03,30.48 7.75,30.48 | U8.42 11.55,43.43 11.43,43.31 10.92,43.31 10.6,43.62 10.6,43.75 C34.1 | C17.2 6.48,37.85 7.11,37.21
  Top 0.305: C27.2 6.86,30.35 | R1.1 7.11,30.35 | C2.2 7.75,28.32 7.11,28.96 | U8.18 21.59,42.93 v21.97,43.31 | U8.42 13.59,43.43 14.22,44.07 v14.22,45.21 | 2.54,54.36 3.17,54.36 3.53,54.71 USB2.B1_A12 3.53,55.02 3.17,55.37 2.41,55.37 2.43,55.39 USB2.S4 | 11.05,54.36 10.29,54.36 9.98,54.66 USB2.A1_B12 9.98,55.07 10.29,55.37 10.99,55.37 USB2.S3 | C40.1 23.75,44.7 | U8.5 15.76,39.99 v15.75,40.01 | 10.41,35.05 10.16,34.8 10.16,33.78 10.31,33.63 U1.3 12.98,33.63 14.22,32.38 14.22,28.89 v14.16,28.83 13.84,28.83 13.62,28.61 U1.14 13.62,26.58 13.14,26.1 v13.14,25.59 | U1.16 14.62,28.43 14.22,28.83 | U1.19 16.12,28.57 16.38,28.83 | U1.29 18.81,31.13 18.41,30.73 | U1.48 13.12,35.73 12.95,35.56 11.56,35.56 v11.43,35.43 | U8.35 14.26,46.39 v14.22,46.35 | C16.- 7.94,43.34 v8.75,42.53 | C41.1 8.38,41.66 8.76,42.04 8.76,42.55
  Top 0.406: C32.2 6.35,40.01 v6.41,40.07 6.73,40.39 C14.2 6.73,41.02 5.97,40.26 | 6.35,39.12 C17.2 6.35,37.97 5.84,38.48 | C39.1 C3.2 7.75,32.07 7.78,32.04 | 7.78,32.04 v7.81,32 | 7.78,32.04 7.75,32 C27.2 R1.1 | R1.1 6.99,29.72 | R1.1 C2.2 C23.1 | C35.2 C23.1 | C23.1 7.75,26.1 v7.11,25.46 | C26.1 25.27,38.86 v25.78,38.35 | v25.78,31.62 25.15,30.99 C25.1 C15.1 C1.1 | C1.1 C29.1 25.91,26.16 26.16,25.91 v26.16,24.77 | C1.1 25.91,27.69 26.16,27.43 v26.16,27.18 | v26.16,23.62 26.16,23.24 25.78,22.86 R31.1 25.15,21.97 24.77,21.59 v24.51,21.59 | C32.2 5.71,40.01 | C32.2 6.35,39.12 | 6.35,39.12 5.84,38.61 | C40.1 24.26,44.7 24.13,44.83 v23.62,44.83 23.75,44.7 23.75,44.58 24.26,44.58 C40.1
  Top 0.61: C18.1 v9.78,51.05 | C36.1 13.72,25.02 v13.14,25.59 | C19.1 12.19,25.08 v11.75,25.53 | v23.24,21.59 23.37,21.72 C28.1 24.38,22.73 | 24.38,22.73 25.02,22.73 R31.1 25.91,22.1 | 24.38,22.73 24.38,21.59
  other vias: 10.67,51.05 10.67,50.16 10.16,49.53 10.16,46.74 7.29,45.54 11.18,46.61 15.24,46.35 25.78,34.67 26.42,31.43 24.26,20.07 24.51,17.27 27.43,13.46 16.7,29.08 6.99,29.78 4.57,29.78 4.57,36.2 0.64,58.42 0.64,55.88 0.64,53.34 0.64,38.1 0.64,24.13 0.64,13.78 27.94,10.16 27.94,38.1 27.94,35.56 22.86,55.88 22.86,53.34 28.57,60.96 22.86,61.59 17.72,61.59 12.7,60.96 7.62,60.96 5.08,60.96 10.16,60.96 13.53,55.88 15.24,55.88 17.78,55.88 3.43,24.51 10.79,28.32 16.83,32.26 2.79,6.99 5.21,6.6 5.33,8.76 3.94,12.95 4.06,16.76 4.06,15.88 24.13,5.71 10.22,26.61 17.72,29.34 8.18,45.54 18.8,55.88 21.34,57.4 25.65,57.53 25.65,59.69 2.29,53.34 7.1,42.53 26.92,60.96 14.1,48.77 16.32,32.89 0.89,4.95 2.54,14.54 1.4,16.57 2.03,18.99 1.02,21.27 7.87,20 3.81,25.46 26.8,15.49 26.92,18.41 26.92,19.81 27.05,22.1 26.8,8.64
  pour Top (isolate 0.254, rank 6): 0,62.23 29.84,62.23 29.84,0 0,0
  pour Bottom (isolate 0.254, rank 6): 0,62.23 29.84,62.23 29.84,0 0,0
  pour Top (isolate 0.254, no thermals): 10.29,52.7 10.54,52.7 10.79,52.45 10.79,51.56 11.18,51.18 12.57,51.18 12.83,50.93 12.83,49.4 12.45,49.02 10.54,49.02 10.16,49.4 10.16,50.42 9.53,51.05 9.53,52.58 9.65,52.7
  pour Top (isolate 0.254, no thermals): 8.38,46.86 7.75,46.86 7.11,46.23 7.11,43.05 6.35,42.29 6.35,41.15 6.6,40.89 8.38,40.89 8.76,41.27 8.76,43.94 9.02,44.2 10.54,44.2 11.3,44.96 11.3,46.61 11.05,46.86
LINKLED  (via drill 0.3 pad 0.61)
  Top 0.305: U1.25 21.63,29.13 v21.72,29.21
  Bottom 0.203: 21.72,19.3 21.72,19.05 22.73,18.03 22.73,16.38 18.41,12.06 18.41,10.04 J1.14
  Bottom 0.305: v21.72,29.21 21.72,19.3
MISO  (via drill 0.3 pad 0.61)
  Top 0.152: U1.34 18.77,33.63 v18.16,33.02 | U8.21 19.32,44.43 v19.18,44.58
  Bottom 0.152: J14.4 26.45,29.34 24.89,29.34 21.84,32.38 18.8,32.38 v18.16,33.02 18.16,33.27 18.67,33.78 19.18,33.78 19.68,34.29 19.68,35.43 18.16,36.96 18.16,41.53 19.81,43.18 19.81,43.94 v19.18,44.58
MOSI  (via drill 0.3 pad 0.61)
  Top 0.152: U1.35 18.38,34.13 v17.27,33.02 | U8.19 19.43,43.43 v19.18,43.69
  Bottom 0.152: J14.5 26.92,26.86 26.92,28.32 26.29,28.96 24.77,28.96 21.72,32 18.29,32 v17.27,33.02 17.27,33.15 18.29,34.16 19.05,34.16 19.3,34.42 19.3,35.31 17.78,36.83 17.78,42.29 v19.18,43.69
N$1
  Top 0.254: U1.30 22.73,31.63 C25.2 24.38,31.5 X2.1
N$2
  Top 0.152: R9.1 3.56,9.91 3.56,8.26 4.19,7.62 PWR1.-
N$3  (via drill 0.3 pad 0.61)
  Top 0.406: USB2.A4_B9 9.13,55.51 v8.76,55.88
  other vias: 8.76,56.52 4.32,53.98 4.32,53.21
  pour Top (isolate 0.254, no thermals): 8.89,55.12 8.89,55.37 8.51,55.75 8.51,56.64 8.64,56.77 9.27,56.77 9.4,56.64 9.4,55.5 9.27,55.37 9.27,54.74 9.14,54.61 9.02,54.61 8.89,54.74
  pour Bottom (isolate 0.254, no thermals): 9.27,56.9 8.26,56.9 8,56.64 8,55.37 7.62,54.99 4.32,54.99 3.81,54.48 3.81,53.09 4.19,52.7 8.64,52.7 9.53,53.59 9.53,56.64
  pour Top (isolate 0.254, no thermals): 4.32,55.05 4.45,55.05 4.51,54.99 4.51,54.42 5.14,53.78 5.14,51.56 5.02,51.44 3.49,51.44 3.17,51.75 3.17,53.47 4.13,54.42 4.13,54.86
N$4
  Top 0.305: R7.1 21.34,18.54 21.97,17.91 21.97,16 18.41,12.45 18.41,7.5 J1.13
N$5
  Top 0.305: R8.1 19.81,21.72 20.7,20.83 20.7,19.3 19.43,18.03 19.43,15.49 12.45,8.51 10.03,8.51 J1.11
N$6
  Top 0.152: SPD.+ R10.1
N$7  (via drill 0.3 pad 0.61)
  Top 0.152: U1.24 18.62,28.02 18.8,28.19 19.18,28.19 v19.43,27.94 | v1.27,6.73 SPD.-
  Bottom 0.152: v19.43,27.94 19.43,22.1 18.54,21.21 7.37,21.21 5.71,19.56 5.71,11.18 v1.27,6.73
N$11
  Top 0.254: U8.1 13.76,38.65 13.59,38.48 12.06,38.48 11.81,38.48 11.56,38.48 10.16,37.08 X1.2 8.64,37.08 C17.1
N$12
  Top 0.254: U8.2 14.26,39.59 13.84,40.01 9.78,40.01 X1.1 8.64,40.13 C32.1
N$13
  Top 0.305: U8.43 9.9,42.93 C34.2
N$16
  Top 0.406: J1.4 13.08,21.08 13.72,21.72 C36.2 R45.1
N$23
  Top 0.152: C11.2 9.14,22.8 8.57,22.23 8.57,21.84 8.7,21.72 10.16,21.72 10.79,21.08 10.79,18.67 10.54,18.41 J1.2
N$24
  Top 0.152: C12.2 8.26,22.23 8.26,21.72 8.57,21.4 9.97,21.4 10.48,20.89 10.48,18.86 10.16,18.54 9.4,18.54 9.27,18.67 J1.1
N$26
  Top 0.152: PWR.+ R28.2
N$27  (via drill 0.3 pad 0.61)
  Top 0.152: R3.4 5.45,32.39 5.08,32.77 v5.08,33.02 | U1.38 18.12,35.34 v18.67,34.8
  Bottom 0.152: v5.08,33.02 5.08,33.15 5.84,33.91 14.61,33.91 16.26,35.56 17.91,35.56 v18.67,34.8
N$30  (via drill 0.3 pad 0.61)
  Top 0.152: R3.3 5.84,31.36 5.97,31.5 5.97,32.89 v5.84,33.02 | U1.39 17.62,34.95 v17.78,34.8
  Bottom 0.152: v5.84,33.02 6.35,33.53 14.73,33.53 16.26,35.05 17.53,35.05 v17.78,34.8
N$31  (via drill 0.3 pad 0.61)
  Top 0.152: R3.2 5.85,30.86 6.35,31.37 6.35,32.64 v6.73,33.02 | U1.40 17.12,34.44 v17.4,34.16
  Bottom 0.152: v6.73,33.02 14.73,33.02 16.38,34.67 16.89,34.67 v17.4,34.16
N$32  (via drill 0.3 pad 0.61)
  Top 0.152: R3.1 6.06,30.31 6.86,31.11 v6.86,32.13 | U1.41 16.62,34.17 v16.64,34.16
  Bottom 0.152: v6.86,32.13 7.37,32.64 15.11,32.64 v16.64,34.16
N$33  (via drill 0.3 pad 0.61)
  Top 0.152: R2.4 5.45,36.2 4.95,36.7 4.95,37.47 v5.33,37.85 | U1.42 16.12,37.21 16.38,37.47 v16.38,37.85
  Bottom 0.152: v5.33,37.85 5.46,37.97 16.26,37.97 v16.38,37.85
N$34  (via drill 0.3 pad 0.61)
  Top 0.305: R24.2 v11.43,22.86 C19.2 12.19,20.2 J1.3 | v5.33,22.86 R25.1
  Bottom 0.305: v11.43,22.86 v5.33,22.86
N$35  (via drill 0.3 pad 0.61)
  Top 0.152: R2.3 5.84,35.17 6.1,35.43 6.1,36.45 v5.59,36.96 | U1.43 v15.62,37.46 v15.62,37.47
  Bottom 0.152: v5.59,36.96 6.22,37.59 15.49,37.59 v15.62,37.47
N$36  (via drill 0.3 pad 0.61)
  Top 0.152: R2.2 6.23,34.67 6.48,34.92 v6.48,36.96 | U1.44 15.12,35.19 v15.11,35.18
  Bottom 0.152: v6.48,36.96 13.34,36.96 v15.11,35.18
N$37  (via drill 0.3 pad 0.61)
  Top 0.152: R2.1 6.44,34.12 6.86,34.54 6.86,36.07 v7.11,36.32 | U1.45 14.62,35.45 14.22,35.05 v13.97,35.05
  Bottom 0.152: v7.11,36.32 7.24,36.32 7.37,36.45 12.57,36.45 v13.97,35.05
N$50  (via drill 0.3 pad 0.61)
  Top 0.152: U1.23 18.12,28.41 18.29,28.57 21.72,28.57 v22.35,27.94 | R31.2 25.15,24.89 v24.89,25.15
  Bottom 0.152: v22.35,27.94 22.35,27.69 v24.89,25.15
POE+
  Bottom 0.61: J1.9 19.43,20.95 20.32,21.84 20.32,28.45 18.41,30.35 9.53,30.35 8.89,30.99 4.19,30.99 3.05,32.13 3.05,33.34 J15.1
POE-  (via drill 0.3 pad 0.61)
  Top 0.559: J15.2 0.64,31.21 0.64,25.4 6.86,19.18 v6.86,18.67 v7.37,18.16 v7.87,17.65
  Bottom 0.559: J1.10 19.3,15.88 9.65,15.88 v6.86,18.67
RESET  (via drill 0.3 pad 0.61)
  Top 0.152: C35.1 R4.2 4.06,28.19 3.17,27.3 v3.17,26.8 | U8.40 11.41,44.43 11.18,44.2 v11.18,43.81 | K1.2 2.79,22.23 v2.67,22.35
  Bottom 0.152: v11.18,43.81 4.7,43.81 3.3,42.42 3.3,38.86 0.51,36.07 0.51,26.16 1.14,25.53 2.67,25.53 | v3.17,26.8 3.17,26.04 2.67,25.53 | v2.67,22.35 2.67,25.53
RST_N
  Top 0.152: R5.1 23.03,41.82 22.1,40.89 22.1,40.01 21.59,39.5 21.59,35.94 21.08,35.43 18.92,35.43 18.62,35.73 U1.37
RXD2  (via drill 0.3 pad 0.61)
  Top 0.152: U8.38 13.04,45.43 13.34,45.72 v13.34,46.48
  Bottom 0.152: v13.34,46.48 13.34,49.15 15.62,51.44 16.91,51.44 J11.2
RXN
  Top 0.152: U1.5 12.27,32.63 12.38,32.51 13.21,32.51 13.59,32.13 13.59,29.34 12.32,28.07 12.32,27.43 10.29,25.4 8.76,25.4 8.64,25.27 8.64,25.02 9.14,24.51 C11.1
  Top 0.305: R24.1 C11.1
RXP
  Top 0.152: U1.6 12.38,32.13 12.45,32.19 13.02,32.19 13.21,32 13.21,29.46 11.94,28.19 11.94,27.56 10.16,25.78 8.64,25.78 8.26,25.4 8.26,25.02 C12.1
  Top 0.305: C12.1 R25.2
SCK  (via drill 0.3 pad 0.61)
  Top 0.152: U1.33 19.16,33.13 v19.05,33.02 | U8.20 21.7,43.93 v21.97,44.2
  Bottom 0.152: J14.3 24.89,29.84 21.72,33.02 v19.05,33.02 20.07,34.04 20.07,35.56 18.54,37.08 18.54,41.4 20.95,43.81 21.59,43.81 v21.97,44.2
SCL
  Top 0.152: U8.32 15.76,50.56 16.76,51.56 16.76,57.96 J10.1
SCS_N  (via drill 0.3 pad 0.61)
  Top 0.152: U1.32 22.09,32.63 22.35,32.89 22.35,39.12 23.11,39.88 v23.11,40.64 23.25,40.77 R5.3 | U8.27 18.26,48.36 v18.29,48.39
  Bottom 0.152: v23.11,40.64 23.94,41.47 24,41.53 25.02,42.55 25.02,46.23 22.86,48.39 v18.29,48.39
SDA
  Top 0.152: U8.31 16.26,50.55 17.08,51.37 17.08,57.96 J10.2
SWCLK  (via drill 0.3 pad 0.61)
  Top 0.152: J15.4 1.91,28.96 3.62,30.67 3.62,32.96 v3.87,33.21 | U8.45 13.7,41.93 v14.1,41.53
  Bottom 0.152: v3.87,33.21 3.87,33.59 3.05,34.42 3.05,37.59 4.83,39.37 11.43,39.37 13.59,41.53 v14.1,41.53
SWDIO  (via drill 0.3 pad 0.61)
  Top 0.152: J15.5 1.91,26.8 3.94,28.83 3.94,32.26 4.32,32.64 v4.45,32.64 | v13.72,40.77 13.72,41.02 13.31,41.43 U8.46
  Bottom 0.152: v4.45,32.64 4.45,33.66 3.43,34.67 3.43,37.47 4.95,38.99 11.94,38.99 v13.72,40.77
TOCAP
  Top 0.305: U1.20 16.62,26.4 16.38,26.16 16.38,25.65 16.76,25.27 22.61,25.27 C28.2
TXD2  (via drill 0.3 pad 0.61)
  Top 0.152: U8.37 12.66,45.93 12.83,46.1 12.83,46.74 v12.57,46.99
  Bottom 0.152: v12.57,46.99 12.57,49.1 J11.1
TXN  (via drill 0.3 pad 0.61)
  Top 0.152: J1.6 15.24,17.65 15.24,18.29 15.37,18.41 17.65,18.41 18.29,19.05 18.29,20.7 17.72,21.27 17.72,21.91 v17.91,22.1 17.91,22.48 R27.1 | v15.88,29.46 15.62,29.72 15.62,32.51 13.59,34.54 12.38,34.54 12.3,34.63 U1.1
  Bottom 0.152: v17.91,22.1 17.78,22.23 17.78,24.89 18.29,25.4 18.29,27.05 17.65,27.69 16,27.69 15.62,28.07 15.62,29.21 v15.88,29.46
TXP  (via drill 0.3 pad 0.61)
  Top 0.152: J1.5 14.35,19.69 15.24,18.8 17.53,18.8 17.91,19.18 17.91,20.57 17.34,21.14 17.34,21.91 v17.14,22.1 17.14,22.35 16.76,22.73 R30.1 | v14.99,29.46 15.24,29.72 15.24,32.38 13.4,34.23 12.38,34.23 12.28,34.13 U1.2
  Bottom 0.152: v17.14,22.1 17.4,22.35 17.4,25.02 17.91,25.53 17.91,26.92 17.53,27.3 15.88,27.3 15.24,27.94 15.24,29.21 v14.99,29.46
USB+
  Top 0.152: U8.34 14.76,48.22 14.86,48.32 14.86,49.15 14.1,49.91 14.1,52.7 13.46,53.34 7.56,53.34 7.05,53.85 7.05,54.23 6.98,54.3 USB2.A6 6.98,56.33 6.86,56.45 6.1,56.45 5.84,56.2 5.84,55.63 5.98,55.49 USB2.B6
USB-  (via drill 0.3 pad 0.61)
  Top 0.152: U8.33 15.26,48.18 15.18,48.26 15.18,49.34 14.48,50.04 14.48,52.83 13.59,53.72 7.75,53.72 7.43,54.04 7.43,54.23 7.48,54.28 USB2.B7 7.48,55.87 v7.49,55.88 | USB2.A7 6.48,55.81 v6.41,55.88
  Bottom 0.152: v6.41,55.88 v7.49,55.88
WINT_N
  Top 0.152: U1.36 21.29,34.63 21.97,35.31 21.97,39.37 22.48,39.88 22.48,40.77 22.98,41.27 R5.2
XO
  Top 0.254: U1.31 22.35,32.13 22.73,32.51 22.73,35.43 X2.2 23.62,37.85 C26.2

### Text on the board
tPlace: I2C | UART | RST | USR | S | P | L
bPlace: SCL | SDA | 3V3 | GND | 0 | 3V3 | GND | 1 | TX | RX | 2 | ANALOG | A0 | 3 | Longan Squama Ethernet | 4 | A1 | DIGITAL IO | 3V | 5 | POWER | 6 | 5V | GND | 7 | longan-labs.cc | 12/17/2020 | PoE+ | G | PoE- | 5V | 3V | SCK | SWCLK | V1.0 | SPI | MISO | SWDIO | MOSI